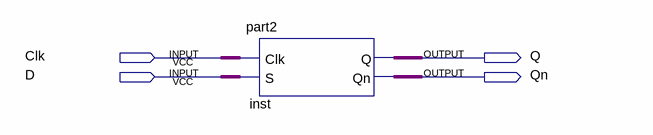
[diagram p0: schematic sheet]
// Quartus schematic lab3_part2.bdf as structural Verilog: 1 symbols, 4 pins
module lab3_part2 (
  input  Clk,
  input  D,
  output Q,
  output Qn
);

  part2 inst (.Clk(Clk), .S(D), .Q(Q), .Qn(Qn));
endmodule
